# EAGLE design Plotter (EAGLE 8.2.1)
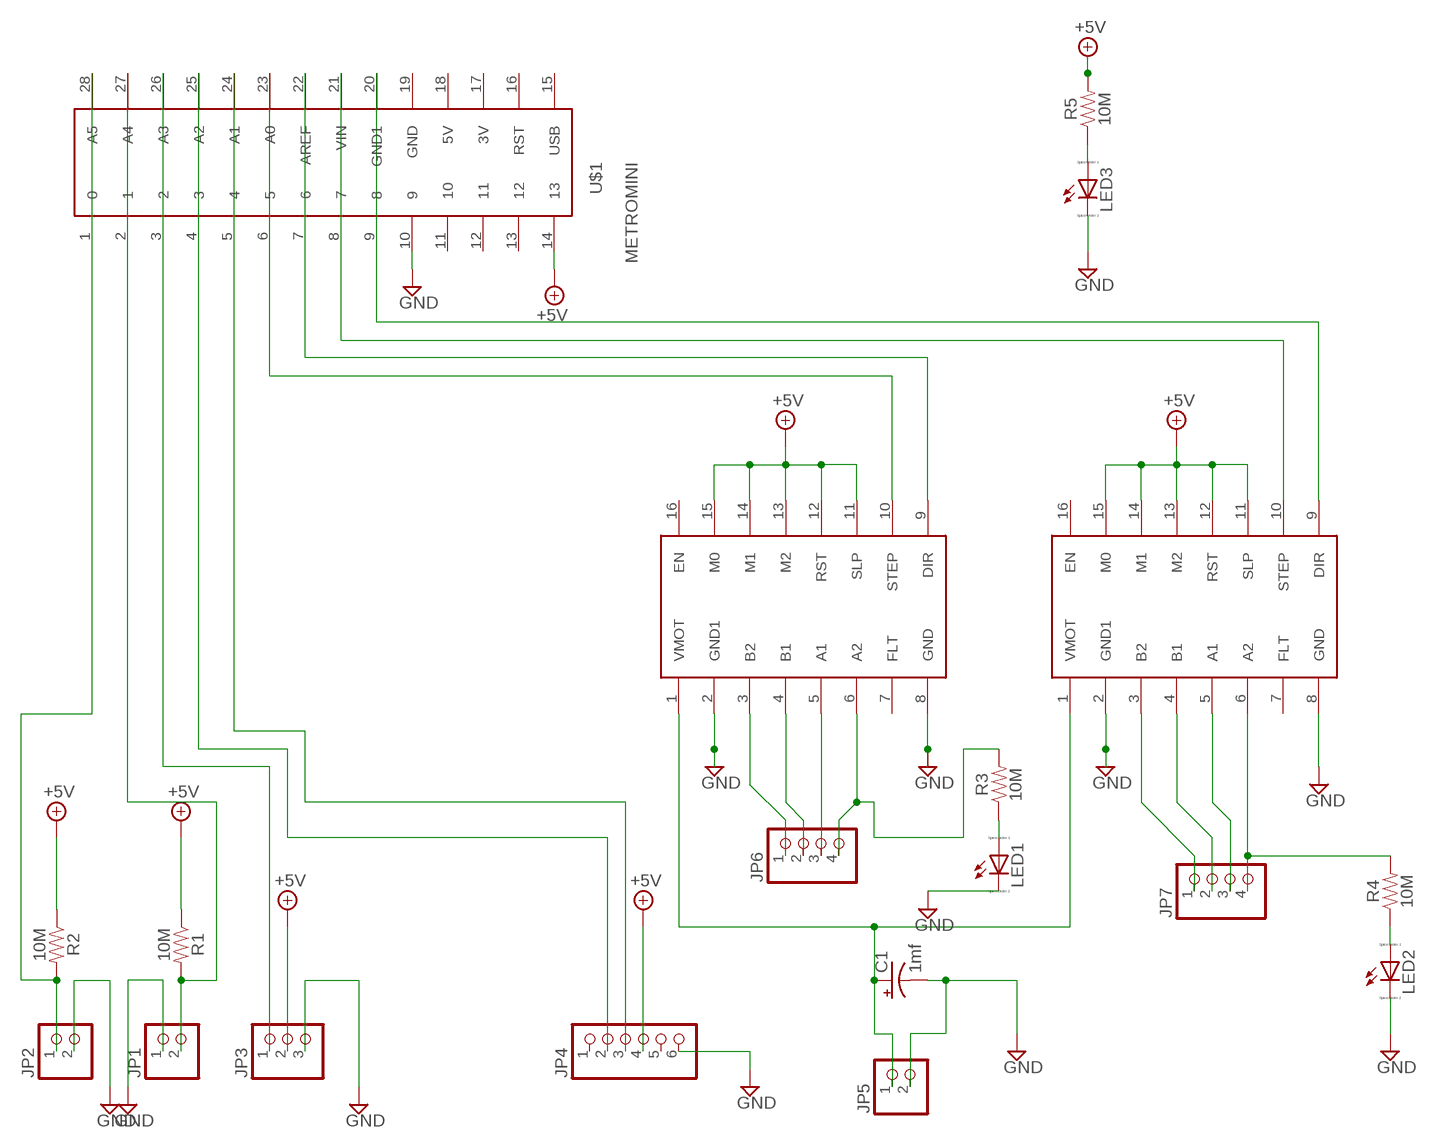
[diagram p0: schematic, sheet 1]

## Parts
C1  1mf  1000UF-RADIAL-5MM-35V-20%-KIT  [CPOL-RADIAL-5MM-10MM-KIT]
JP1  PINHD-1X2  [1X02]
JP2  PINHD-1X2  [1X02]
JP3  PINHD-1X3  [1X03]
JP4  PINHD-1X6  [1X06]
JP5  PINHD-1X2  [1X02]
JP6  PINHD-1X4  [1X04]
JP7  PINHD-1X4  [1X04]
LED1  LED_ELD260  [LED_LD260]
LED2  LED_ELD260  [LED_LD260]
LED3  LED_ELD260  [LED_LD260]
R1  10M  10MOHM-HORIZ-1/4W-5%  [AXIAL-0.3]
R2  10M  10MOHM-HORIZ-1/4W-5%  [AXIAL-0.3]
R3  10M  10MOHM-HORIZ-1/4W-5%  [AXIAL-0.3]
R4  10M  10MOHM-HORIZ-1/4W-5%  [AXIAL-0.3]
R5  10M  10MOHM-HORIZ-1/4W-5%  [AXIAL-0.3]
U$1  METROMINI  [METROMINI]
U$2  DRV8825  [DRV8825]
U$3  DRV8825  [DRV8825]

## Nets
+5V [power]: JP3.2 JP4.4 R1.P$1 R2.P$1 R5.P$2 U$1.14 U$2.11(SLP) U$2.12(RST) U$2.13(M2) U$2.14(M1) U$2.15(M0) U$3.11(SLP) U$3.12(RST) U$3.13(M2) U$3.14(M1) U$3.15(M0)
GND [gnd]: C1.- JP1.1 JP2.2 JP3.3 JP4.6 JP5.2 LED1.K(C) LED2.K(C) LED3.K(C) U$1.10 U$2.2(GND1) U$2.8(GND) U$3.2(GND1) U$3.8(GND)
N$1: JP1.2 R1.P$2 U$1.27(A4)
N$2: JP2.1 R2.P$2 U$1.28(A5)
N$3: LED1.A R3.P$1
N$4: LED2.A R4.P$1
N$9: JP3.1 U$1.26(A3)
N$10: LED3.A R5.P$1
N$12: JP4.2 U$1.25(A2)
N$13: C1.+ JP5.1 U$2.1(VMOT) U$3.1(VMOT)
N$14: JP4.3 U$1.24(A1)
N$20: JP6.1 U$2.3(B2)
N$21: JP6.2 U$2.4(B1)
N$22: JP6.3 U$2.5(A1)
N$23: JP6.4 R3.P$2 U$2.6(A2)
N$24: JP7.1 U$3.3(B2)
N$25: JP7.2 U$3.4(B1)
N$26: JP7.3 U$3.5(A1)
N$27: JP7.4 R4.P$2 U$3.6(A2)
N$28: U$1.21(VIN) U$3.10(STEP)
N$29: U$1.23(A0) U$2.10(STEP)
N$30: U$1.22(AREF) U$2.9(DIR)
N$31: U$1.20(GND1) U$3.9(DIR)
Unconnected: JP4.1 JP4.5 U$1.1 U$1.2 U$1.3 U$1.4 U$1.5 U$1.6 U$1.7 U$1.8 U$1.9 U$1.11 U$1.12 U$1.13 U$1.15(USB) U$1.16(RST) U$1.17(3V) U$1.18(5V) U$1.19(GND) U$2.7(FLT) U$2.16(EN) U$3.7(FLT) U$3.16(EN)

## Library data of the parts
C1 = SparkFun-Capacitors:1000UF: 1,000µF/1mF ceramic capacitors A capacitor is a passive two-terminal electrical component used to store electrical energy temporarily in an electric field. CAP-08070; PROD_ID: CAP-09538
JP1 JP2 JP5 = pinhead:PINHD-1X2: PIN HEADER
JP3 = pinhead:PINHD-1X3: PIN HEADER
JP4 = pinhead:PINHD-1X6: PIN HEADER
JP6 JP7 = pinhead:PINHD-1X4: PIN HEADER
LED1-LED3 = eagle-ltspice:LED_E: LED Source: http://www.osram.convergy.de Source: www.luxeon.com Source: www.kingbright.com; SPICEMODEL: NONE; SPICEPREFIX: D; SPICETYPE: diode
R1-R5 = SparkFun-Resistors:10MOHM: RES-09327; PROD_ID: RES-09327
U$1 = julian:METROMINI
U$2 U$3 = julian:DRV8825

## Net classes
0 default: width 0.457 mm, drill 0.457 mm, clearance 0.457 mm
1 power: width 0.457 mm, drill 0.457 mm, clearance 0.457 mm
2 gnd: width 0.457 mm, drill 0.457 mm, clearance 0.457 mm
3 usbvcc: width 0.457 mm, drill 0.457 mm, clearance 0.457 mm
4 aref: width 0.254 mm, drill 0.457 mm, clearance 0.457 mm

## Board
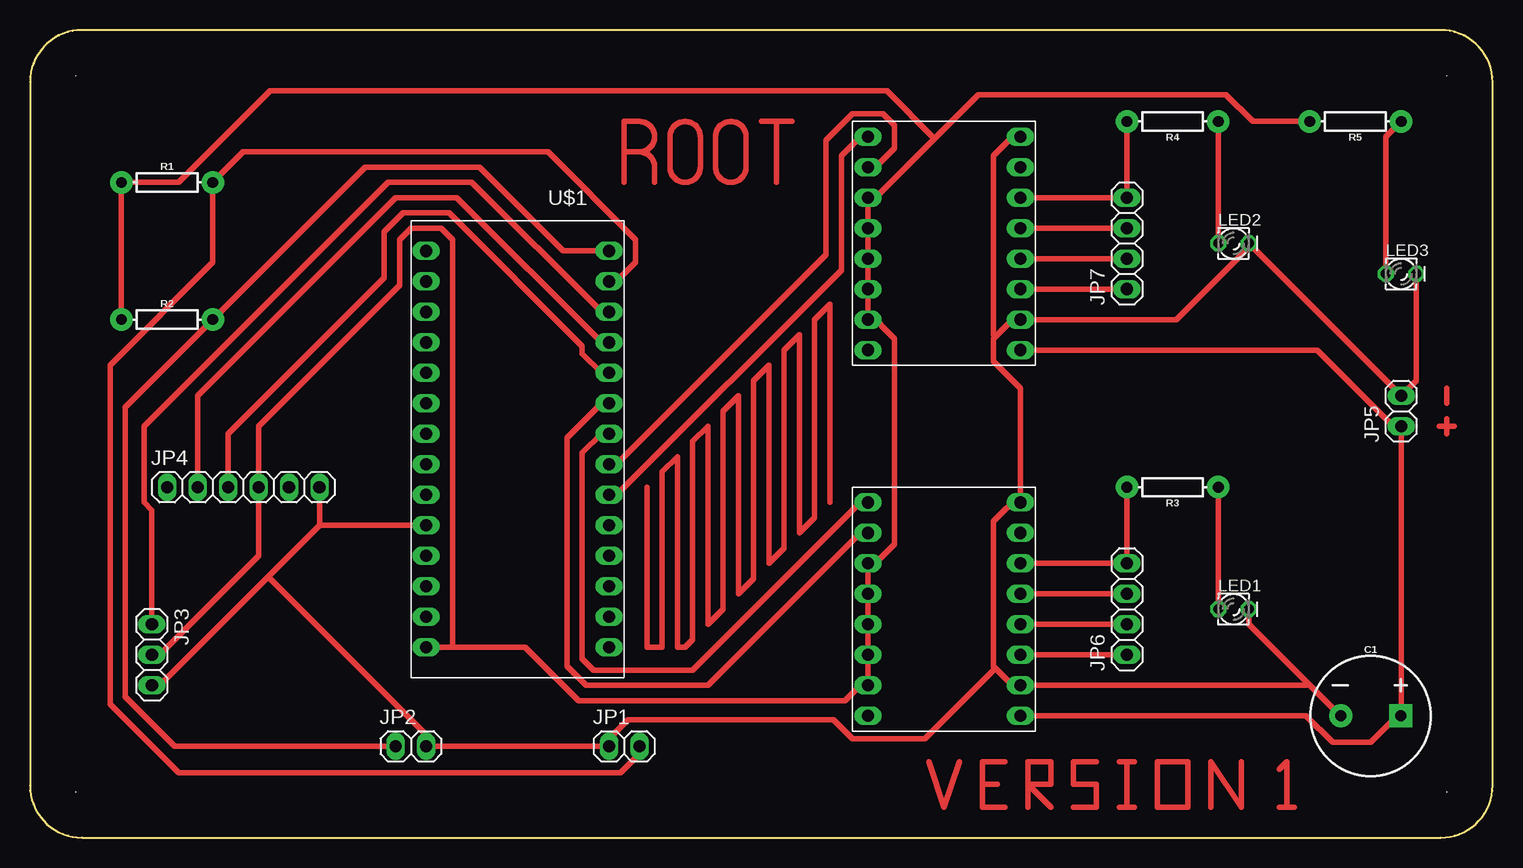
[diagram p1: board, top side]

Size 121.92 x 67.31 mm. Coordinates in mm from the lower left corner, seen from the top.
Outline: 117.58,67.31 4.34,67.31 arc90 0,62.97 0,4.34 arc90 4.34,0 117.58,0 arc90 121.92,4.34 121.92,62.97 arc90 117.58,67.31
Copper layers (1*16): Top 0.035mm / dielectric 1.5mm / Bottom 0.035mm
Design rules "OthermillDRC_1_32_v2": minimum track width 8mil, minimum drill 0.8mm, track to track 0.794003125mm, track to pad 0.794003125mm, pad to pad 0.794003125mm, via to via 0.794003125mm, smd to smd 0mil, copper to edge 0mil, drill to drill 1mil, minimum pad ring 10mil, minimum via ring 10mil, stop-mask expansion 1mil, vias tented up to drill 30mil, thermal gap 10mil
Holes 0 mm at 3.81,3.81 118.11,3.81 118.11,63.5 3.81,63.5

### Footprints (pad centres in the part's own frame; a part is rotated, then mirrored left to right if it is on the bottom)
CPOL-RADIAL-5MM-10MM-KIT = drill 0.9 pad 1.93 square: + 2.5,0 | drill 0.9 pad 1.93: - -2.5,0
1X02 = drill 1.016 long: 1 -1.27,0; 2 1.27,0
1X03 = drill 1.016 long: 1 -2.54,0; 2 0,0; 3 2.54,0
1X06 = drill 1.016 long: 1 -6.35,0; 2 -3.81,0; 3 -1.27,0; 4 1.27,0; 5 3.81,0; 6 6.35,0
1X04 = drill 1.016 long: 1 -3.81,0; 2 -1.27,0; 3 1.27,0; 4 3.81,0
LED_LD260 = drill 0.813 octagon: A -1.27,0; K 1.27,0
AXIAL-0.3 = drill 0.9 pad 1.88: P$1 -3.81,0; P$2 3.81,0
METROMINI = drill 1.016 long: 1 -16.51,-3.81; 2 -13.97,-3.81; 3 -11.43,-3.81; 4 -8.89,-3.81; 5 -6.35,-3.81; 6 -3.81,-3.81; 7 -1.27,-3.81; 8 1.27,-3.81; 9 3.81,-3.81; 10 6.35,-3.81; 11 8.89,-3.81; 12 11.43,-3.81; 13 13.97,-3.81; 14 16.51,-3.81; 15 16.51,11.43; 16 13.97,11.43; 17 11.43,11.43; 18 8.89,11.43; 19 6.35,11.43; 20 3.81,11.43; 21 1.27,11.43; 22 -1.27,11.43; 23 -3.81,11.43; 24 -6.35,11.43; 25 -8.89,11.43; 26 -11.43,11.43; 27 -13.97,11.43; 28 -16.51,11.43
DRV8825 = drill 1.016 long: 1 -7.62,-1.27; 2 -5.08,-1.27; 3 -2.54,-1.27; 4 0,-1.27; 5 2.54,-1.27; 6 5.08,-1.27; 7 7.62,-1.27; 8 10.16,-1.27; 9 10.16,11.43; 10 7.62,11.43; 11 5.08,11.43; 12 2.54,11.43; 13 0,11.43; 14 -2.54,11.43; 15 -5.08,11.43; 16 -7.62,11.43

### Placement (x,y rotation side)
C1  111.76,10.16 0 top
JP1  49.53,7.62 0 top
JP2  31.75,7.62 0 top
JP3  10.16,15.24 270 top
JP4  17.78,29.21 0 top
JP5  114.3,35.56 90 top
JP6  91.44,19.05 90 top
JP7  91.44,49.53 90 top
LED1  100.33,19.05 0 top
LED2  100.33,49.53 0 top
LED3  114.3,46.99 0 top
R1  11.43,54.61 0 top
R2  11.43,43.18 0 top
R3  95.25,29.21 180 top
R4  95.25,59.69 180 top
R5  110.49,59.69 180 top
U$1  36.83,32.38 270 top
U$2  81.28,17.78 90 top
U$3  81.28,48.26 90 top

### Tracks (layer width: path | path; a pad name or v marks a point on that pad's centre or on a via)
+5V
  Top 0.457: JP3.2 10.79,15.24 19.05,23.5 JP4.4 19.05,34.29 30.8,46.04 30.8,49.85 31.75,50.8 34.29,50.8 35.24,49.85 35.24,15.88 | 69.85,13.34 U$2.14 U$2.13 U$2.12 U$2.11 70.48,22.86 72.07,24.45 72.07,41.59 69.85,43.81 | 35.24,15.88 41.28,15.88 45.72,11.43 67.94,11.43 69.85,13.34 | 35.24,15.88 U$1.14 | 69.85,13.34 U$2.15 | R2.P$1 R1.P$1 12.38,54.61 20,62.23 71.44,62.23 75.41,58.26 | 69.85,43.81 U$3.14 U$3.13 U$3.12 69.85,52.7 | R5.P$2 101.92,59.69 99.69,61.91 79.06,61.91 75.41,58.26 | 69.85,52.7 75.41,58.26 | 69.85,52.7 U$3.11 | 69.85,43.81 U$3.15
GND
  Top 0.457: JP3.3 10.79,12.7 19.84,21.75 | 24.13,26.04 19.84,21.75 | JP4.6 24.13,26.04 | 24.13,26.04 U$1.10 | 19.84,21.75 33.02,8.57 JP2.2 JP1.1 48.26,8.26 49.85,9.84 66.99,9.84 68.58,8.26 74.61,8.26 80.49,14.13 | LED1.K 101.6,17.78 106.52,12.86 | 106.52,12.86 109.22,10.16 C1.- | 106.52,12.86 106.36,12.7 U$2.2 81.91,12.7 80.49,14.13 | LED3.K 115.57,38.1 JP5.2 LED2.K 101.6,49.21 95.57,43.18 U$3.2 81.91,43.18 80.49,41.75 | 82.55,28.57 82.55,37.47 80.33,39.69 80.33,41.59 80.49,41.75 | U$3.8 81.91,58.42 80.33,56.83 80.33,41.91 80.49,41.75 | 80.49,14.13 80.33,14.29 80.33,26.35 82.55,28.57 | 82.55,28.57 U$2.8
N$1
  Top 0.457: U$1.27 48.9,46.35 50.48,47.94 50.48,49.85 43.18,57.15 17.78,57.15 R1.P$2 15.24,47.94 6.67,39.37 6.67,11.11 12.38,5.4 49.21,5.4 50.8,6.99 JP1.2
N$2
  Top 0.457: JP2.1 12.06,7.62 7.94,11.75 7.94,35.88 R2.P$2 27.94,55.88 37.47,55.88 44.45,48.9 U$1.28
N$3
  Top 0.457: R3.P$1 LED1.A
N$4
  Top 0.457: R4.P$1 LED2.A
N$5
  Top 0.457: 49.53,57.15 49.53,59.69 50.8,59.69 arc-90 52.07,58.42 arc-90 50.8,57.15 | 49.53,57.15 49.53,54.61 | 49.53,57.15 50.8,57.15 | 50.8,57.15 arc-90 52.07,55.88 52.07,54.61
N$6
  Top 0.457: 53.34,58.42 53.34,55.88 arc90 54.61,54.61 arc90 55.88,55.88 55.88,58.42 arc90 54.61,59.69 arc90 53.34,58.42
N$7
  Top 0.457: 57.15,58.42 57.15,55.88 arc90 58.42,54.61 arc90 59.69,55.88 59.69,58.42 arc90 58.42,59.69 arc90 57.15,58.42
N$8
  Top 0.457: 60.96,59.69 62.23,59.69 | 62.23,59.69 62.23,54.61 | 62.23,59.69 63.5,59.69
N$9
  Top 0.457: JP3.1 10.16,27.3 9.53,27.94 9.53,34.29 29.84,54.61 36.83,54.61 47.62,43.81 U$1.26
N$10
  Top 0.457: LED3.A 113.03,58.42 R5.P$1
N$11
  Top 0.457: 74.93,6.35 76.2,2.54 77.47,6.35
N$12
  Top 0.457: JP4.2 13.97,36.83 30.48,53.34 35.56,53.34 47.62,41.27 U$1.25
N$13
  Top 0.457: U$2.1 106.36,10.16 108.58,7.94 111.76,7.94 113.98,10.16 C1.+ 114.3,10.16 JP5.1 113.66,34.29 107.31,40.64 U$3.1
N$14
  Top 0.457: JP4.3 16.51,33.66 29.53,46.67 29.53,50.48 31.11,52.07 34.93,52.07 46.04,40.96 46.04,40.32 47.62,38.73 U$1.24
N$15
  Top 0.457: 79.38,4.45 79.38,6.35 81.28,6.35 | 79.38,4.45 79.38,2.54 81.28,2.54 | 79.38,4.45 80.64,4.45
N$16
  Top 0.457: 83.19,4.45 83.19,6.35 85.09,6.35 85.09,4.45 83.19,4.45 | 83.19,4.45 83.19,2.54 | 83.19,4.45 85.09,2.54
N$17
  Top 0.457: 88.9,6.35 86.99,6.35 86.99,4.45 88.9,4.45 88.9,2.54 86.99,2.54
N$18
  Top 0.457: 91.44,6.35 91.44,2.54
N$19
  Top 0.457: 93.98,6.35 93.98,2.54 96.52,2.54 96.52,6.35 93.98,6.35
N$20
  Top 0.457: JP6.1 U$2.3
N$21
  Top 0.457: JP6.2 U$2.4
N$22
  Top 0.457: JP6.3 U$2.5
N$23
  Top 0.457: U$2.6 JP6.4 R3.P$2
N$24
  Top 0.457: JP7.1 U$3.3
N$25
  Top 0.457: JP7.2 U$3.4
N$26
  Top 0.457: JP7.3 U$3.5
N$27
  Top 0.457: U$3.6 JP7.4 R4.P$2
N$28
  Top 0.457: U$1.21 48.9,31.11 66.36,48.58 66.36,58.1 68.58,60.33 71.12,60.33 72.07,59.37 72.07,57.47 70.48,55.88 U$3.10
N$29
  Top 0.457: U$1.23 47.62,36.2 44.77,33.34 44.77,14.29 46.36,12.7 56.52,12.7 69.21,25.4 U$2.10
N$30
  Top 0.457: U$1.22 47.62,33.66 46.04,32.07 46.04,14.92 46.99,13.97 55.25,13.97 69.21,27.94 U$2.9
N$31
  Top 0.457: U$1.20 48.9,28.57 67.63,47.31 67.63,56.83 69.21,58.42 U$3.9
N$32
  Top 0.457: 98.42,2.54 98.42,6.35 100.96,2.54 100.96,6.35
N$33
  Top 0.457: 104.14,5.71 104.77,6.35 104.77,2.54 | 104.77,2.54 104.14,2.54 | 104.77,2.54 105.41,2.54
N$34
  Top 0.457: 90.8,6.35 92.08,6.35
N$35
  Top 0.457: 90.8,2.54 92.08,2.54
N$36
  Top 0.457: 117.47,34.29 118.74,34.29
N$37
  Top 0.457: 118.11,34.92 118.11,33.66
N$38
  Top 0.457: 118.11,37.47 118.11,36.2
N$39
  Top 0.457: 51.44,29.21 51.44,15.88 52.71,15.88 52.71,30.48 53.98,31.75 53.98,15.88 54.61,15.88 55.25,16.51 55.25,33.02 56.52,34.29 56.52,17.78 57.79,19.05 57.79,35.56 59.05,36.83 59.05,20.32 60.33,21.59 60.33,38.1 61.6,39.37 61.6,22.86 62.87,24.13 62.87,40.64 64.14,41.91 64.14,25.4 65.41,26.67 65.41,43.18 66.67,44.45 66.67,27.94